# Altium schematic sheet PARK-BRAKE.SchDoc
size A4
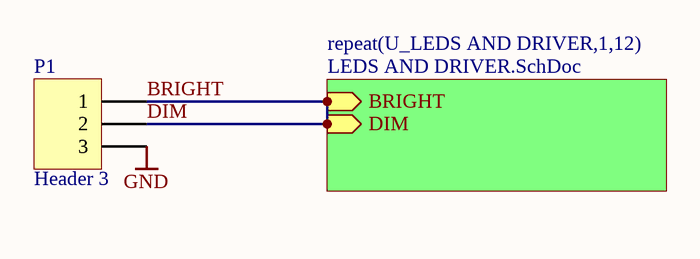
[diagram p0: PARK-BRAKE.SchDoc]

## Parts
P1  Header 3  [TAIL]

## Sub-sheets
repeat(U_LEDS AND DRIVER,1,12) = LEDS AND DRIVER.SchDoc: BRIGHT (in), DIM (in)

## Nets
GND: P1.3
BRIGHT: P1.1 P1.2 ; sheet repeat(U_LEDS AND DRIVER,1,12)/BRIGHT, sheet repeat(U_LEDS AND DRIVER,1,12)/DIM  [also labelled DIM]

## Library data of the parts
P1 = Header 3: Header, 3-Pin; LatestRevisionDate: 17-Jul-2002; LatestRevisionNote: Re-released for DXP Platform.; Publisher: Altium Limited